# EAGLE design placa_painel (EAGLE 9.5.0)

## Sheet 1 of 2
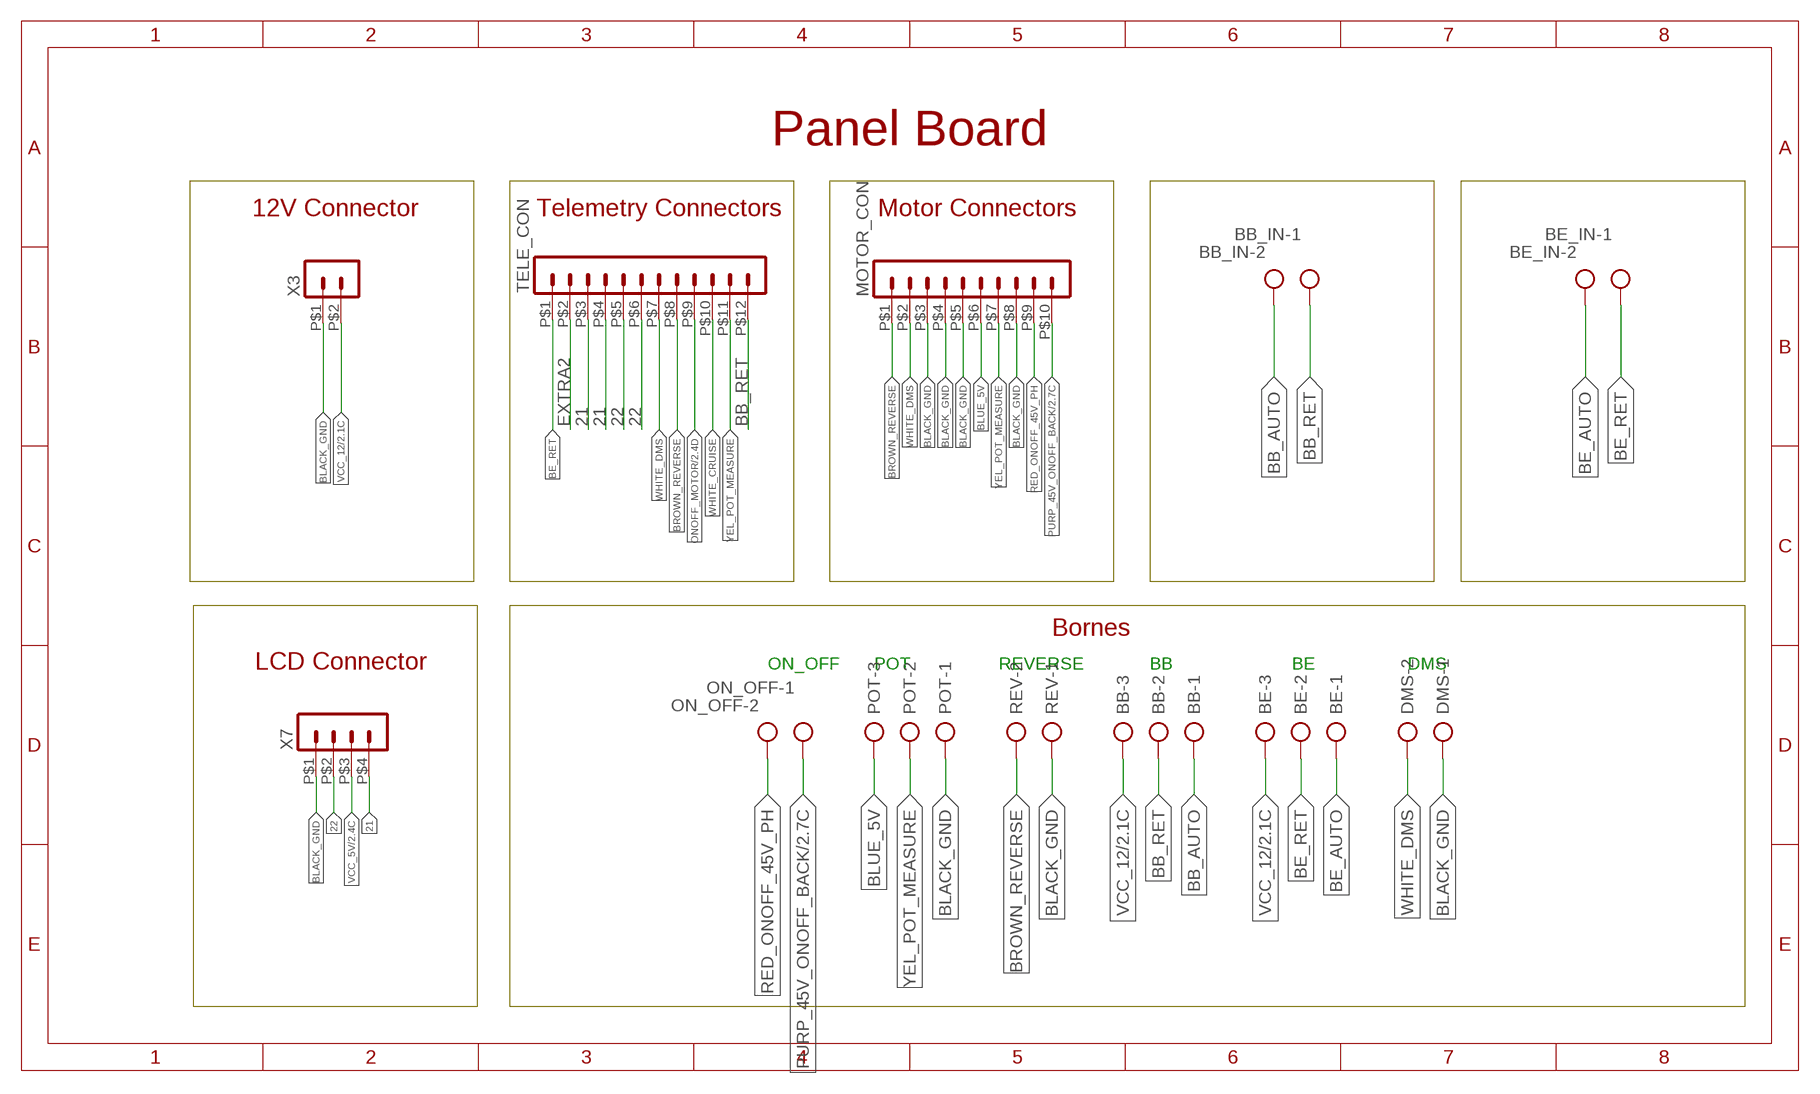
[diagram p0: schematic, sheet 1]

### Parts
BB  AK500/3  [AK500/3]
BB_IN  AK500/2  [AK500/2]
BE  AK500/3  [AK500/3]
BE_IN  AK500/2  [AK500/2]
DMS  AK500/2  [AK500/2]
MOTOR_CON  HEADER_POS10_43045-1012  [43045-1012]
ON_OFF  AK500/2  [AK500/2]
POT  AK500/3  [AK500/3]
REV  AK500/2  [AK500/2]
TELE_CON  HEADER_POS12_43045-1212  [43045-1212]
X3  HEADER_POS2_43045-0212  [43045-0212]
X7  HEADER_POS4_43045-0412  [43045-0412]

### Nets
21: TELE_CON.P$3 TELE_CON.P$4 X7.P$4
22: TELE_CON.P$5 TELE_CON.P$6 X7.P$2
BB_AUTO: BB.1 BB_IN.2
BB_RET: BB.2 BB_IN.1 TELE_CON.P$12
BE_AUTO: BE.1 BE_IN.2
BE_RET: BE.2 BE_IN.1 TELE_CON.P$1
BLACK_GND: DMS.1 MOTOR_CON.P$3 MOTOR_CON.P$4 MOTOR_CON.P$5 MOTOR_CON.P$8 POT.1 REV.1 X3.P$1 X7.P$1 ; also sheet 2
BLUE_5V: MOTOR_CON.P$6 POT.3
BROWN_REVERSE: MOTOR_CON.P$1 REV.2 TELE_CON.P$8
EXTRA2: TELE_CON.P$2
ONOFF_MOTOR: TELE_CON.P$9 ; also sheet 2
PURP_45V_ONOFF_BACK: MOTOR_CON.P$10 ON_OFF.1 ; also sheet 2
RED_ONOFF_45V_PH: MOTOR_CON.P$9 ON_OFF.2
VCC_5V: X7.P$3 ; also sheet 2
VCC_12: BB.3 BE.3 X3.P$2 ; also sheet 2
WHITE_CRUISE: TELE_CON.P$10
WHITE_DMS: DMS.2 MOTOR_CON.P$2 TELE_CON.P$7
YEL_POT_MEASURE: MOTOR_CON.P$7 POT.2 TELE_CON.P$11

### Notes on the sheet
- Panel Board
- 12V Connector | Telemetry Connectors | Motor Connectors
- Bornes
- LCD Connector
- ON_OFF | POT | REVERSE | BB | BE | DMS

## Sheet 2 of 2
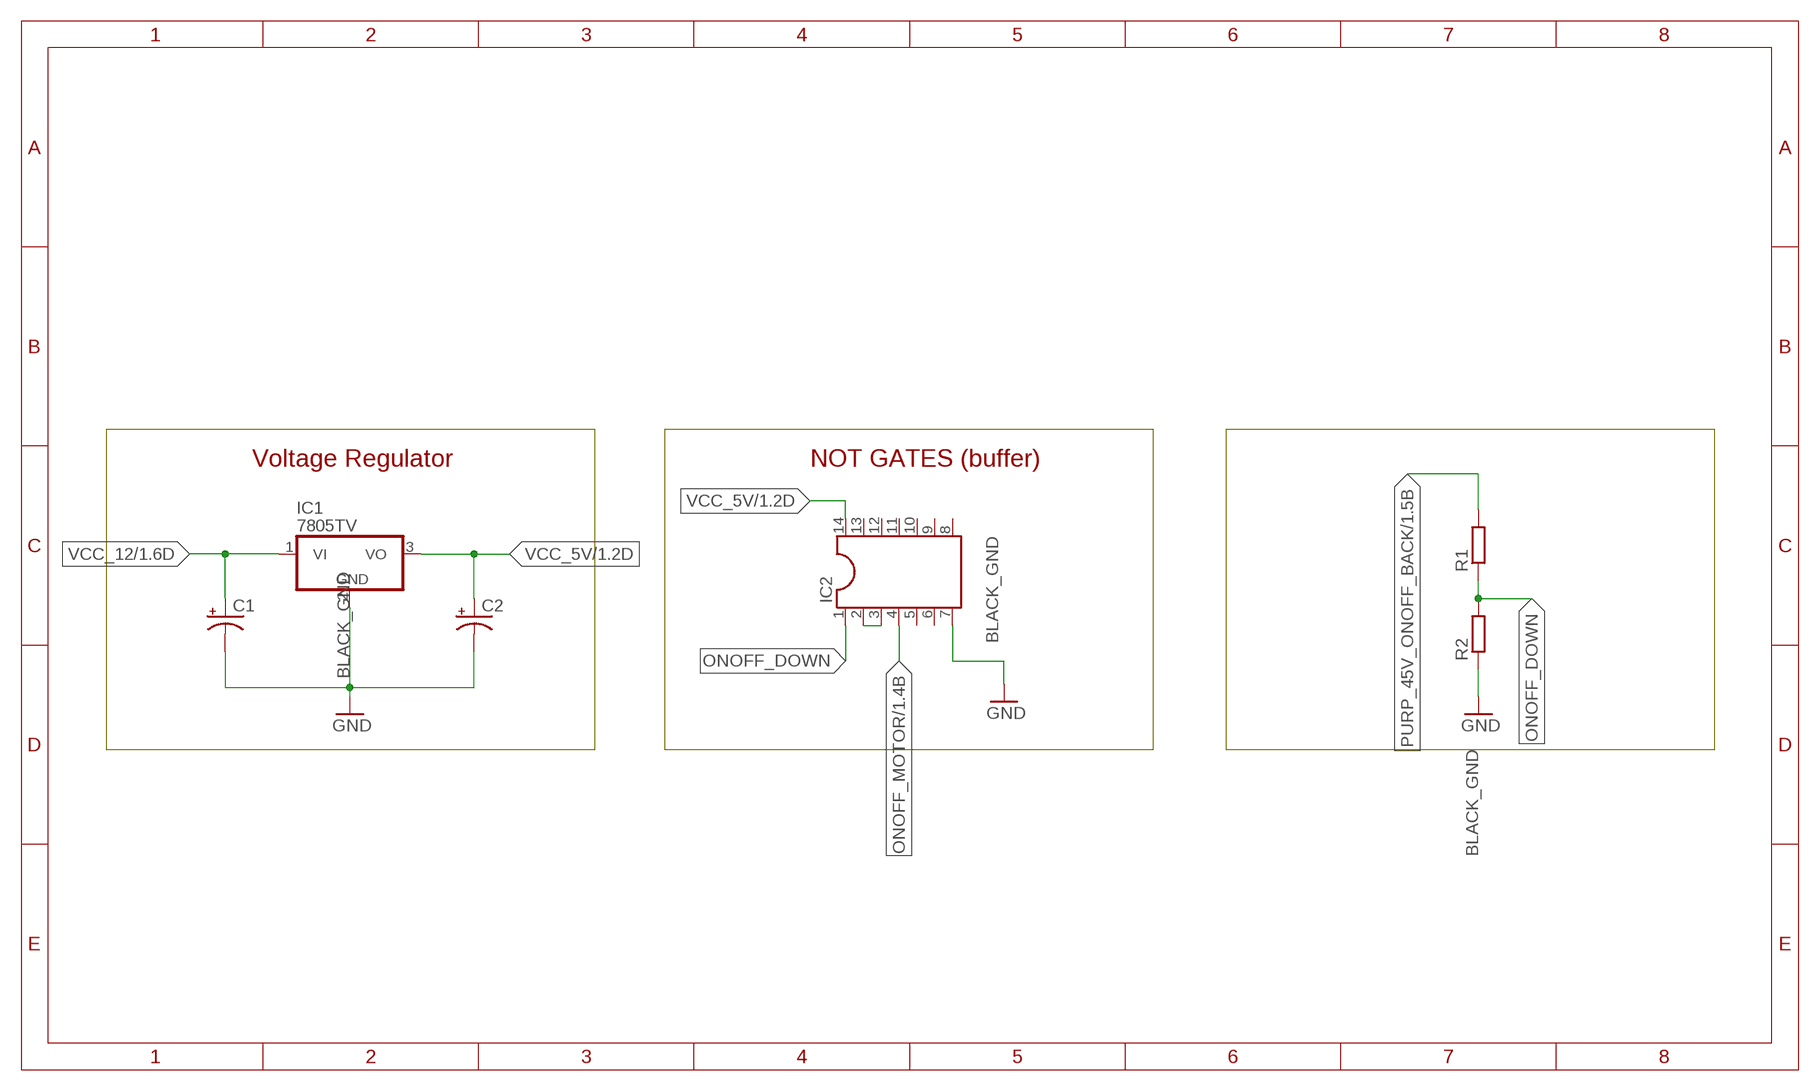
[diagram p1: schematic, sheet 2]

### Parts
C1  CPOL-USE5-5  [E5-5]
C2  CPOL-USE5-5  [E5-5]
IC1  7805TV  [TO220V]
IC2  DIL14  [DIL14]
R1  R-EU_0204/7  [0204/7]
R2  R-EU_0204/7  [0204/7]

### Nets
BLACK_GND: C1.- C2.- IC1.2(GND) IC2.7 R2.1 ; supply symbol labelled GND ; also sheet 1
N$4: IC2.2 IC2.3
ONOFF_DOWN: IC2.1 R1.1 R2.2
ONOFF_MOTOR: IC2.4 ; also sheet 1
PURP_45V_ONOFF_BACK: R1.2 ; also sheet 1
VCC_5V: C2.+ IC1.3(VO) IC2.14 ; also sheet 1
VCC_12: C1.+ IC1.1(VI) ; also sheet 1
Unconnected: IC2.5 IC2.6 IC2.8 IC2.9 IC2.10 IC2.11 IC2.12 IC2.13

### Notes on the sheet
- Voltage Regulator | NOT GATES (buffer)

## Library data of the parts
BB BE POT = con-ptr500:AK500/3: CONNECTOR; OC_FARNELL: unknown; OC_NEWARK: unknown
BB_IN BE_IN DMS ON_OFF REV = con-ptr500:AK500/2: CONNECTOR; OC_FARNELL: unknown; OC_NEWARK: unknown
C1 C2 = rcl:CPOL-US: POLARIZED CAPACITOR, American symbol; SPICEPREFIX: C
IC1 = linear:78*: Positive VOLTAGE REGULATOR Source: http://cache.national.com/ds/LM/LM78L05.pdf http://www.fairchildsemi.com/ds/LM/LM7805.pdf
IC2 = ic-package:DIL14: Dual In Line / Socket
MOTOR_CON = con-molex-micro-fit-3_0:HEADER_POS10_?: Molex - Micro-Fit 3.0 Series connector, 3.00mm (0.118") pitch header, 10 positions.
R1 R2 = rcl:R-EU_: RESISTOR, European symbol; SPICEPREFIX: R
TELE_CON = con-molex-micro-fit-3_0:HEADER_POS12_?: Molex - Micro-Fit 3.0 Series connector, 3.00mm (0.118") pitch header, 12 positions.
X3 = con-molex-micro-fit-3_0:HEADER_POS2_?: Molex - Micro-Fit 3.0 Series connector, 3.00mm (0.118") pitch header, 2 positions.
X7 = con-molex-micro-fit-3_0:HEADER_POS4_?: Molex - Micro-Fit 3.0 Series connector, 3.00mm (0.118") pitch header, 4 positions.

## Board
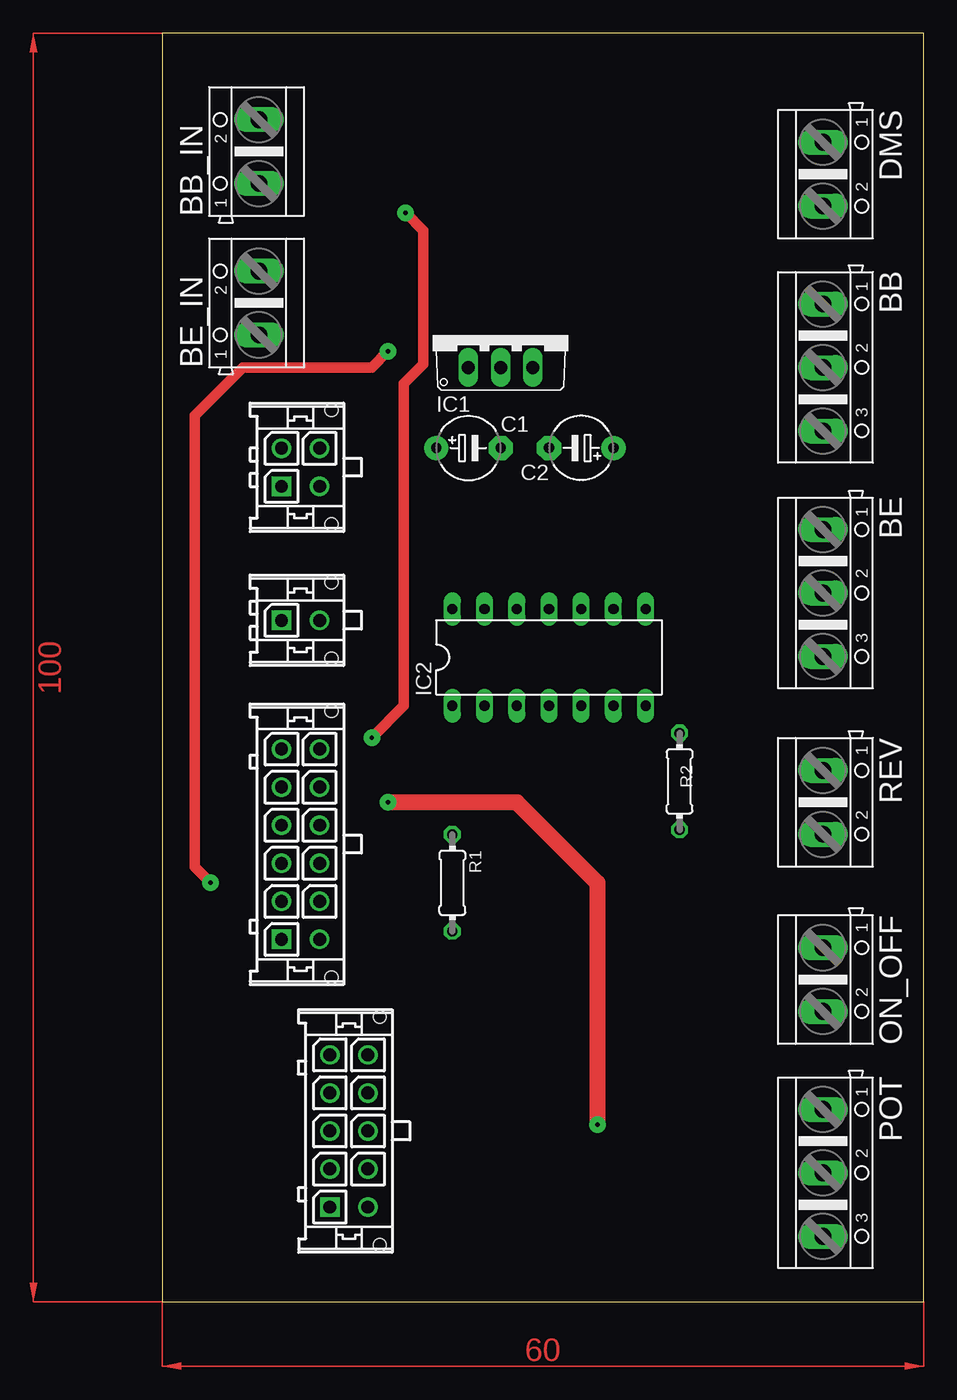
[diagram p2: board, top side]
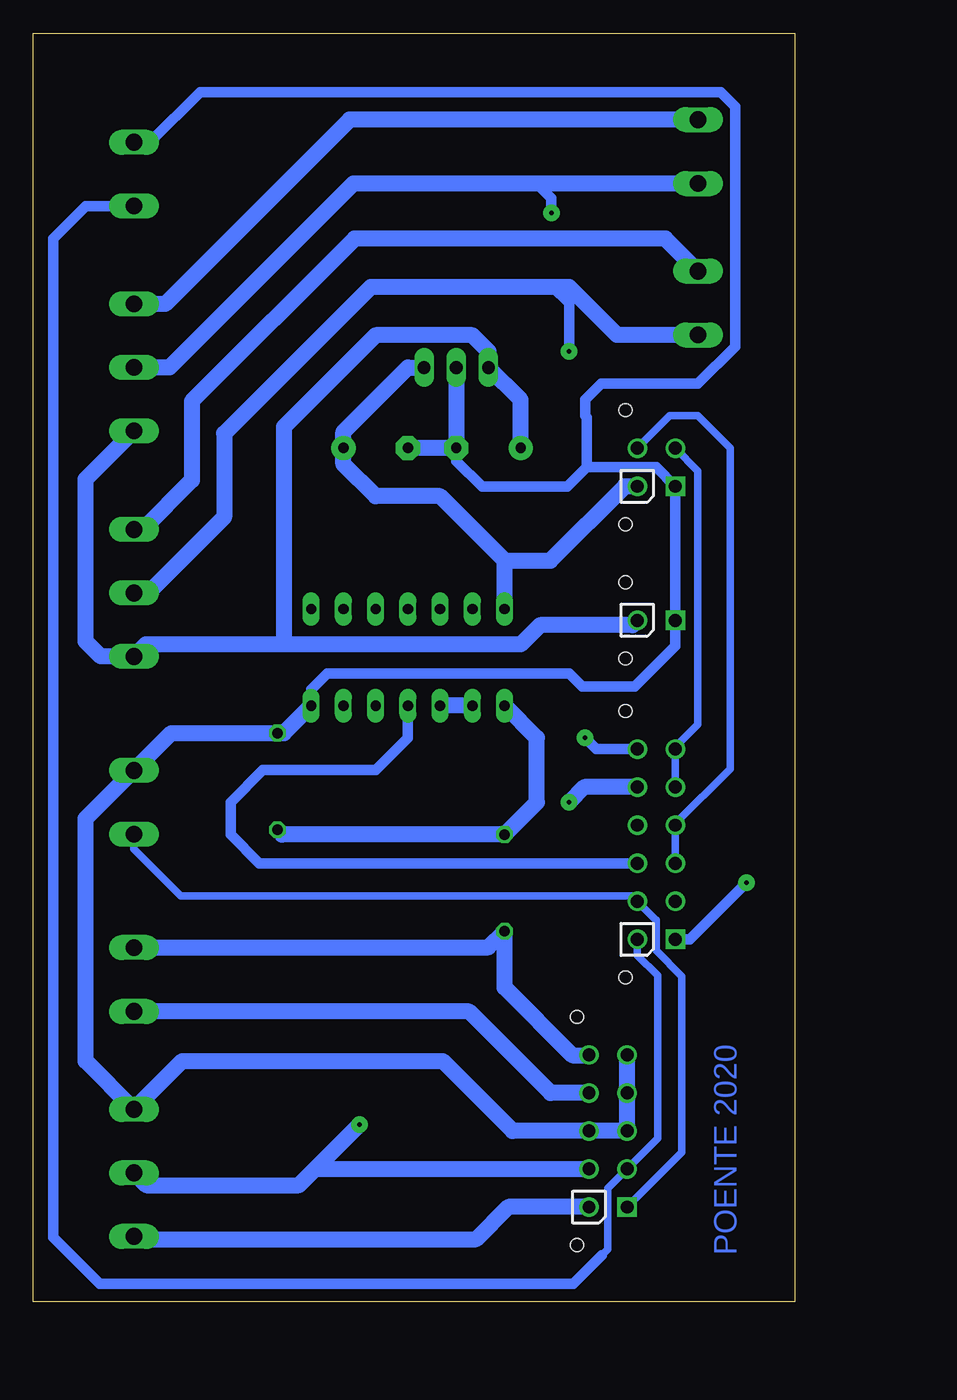
[diagram p3: board, bottom side, seen from below]

Size 60 x 100 mm. Coordinates in mm from the lower left corner, seen from the top.
Outline: 0,0 60,0 60,100 0,100 0,0
Copper layers (1*16): Top 0.035mm / dielectric 1.5mm / Bottom 0.035mm
Design rules "default": minimum track width 6mil, minimum drill 0.35mm, track to track 6mil, track to pad 6mil, pad to pad 6mil, via to via 6mil, smd to smd 6mil, copper to edge 40mil, drill to drill 6mil, minimum pad ring 10mil, minimum via ring 8mil, stop-mask expansion 4mil, vias tented up to drill 0mil, thermal gap 10mil

### Footprints (pad centres in the part's own frame; a part is rotated, then mirrored left to right if it is on the bottom)
AK500/3 = drill 1.321 long: 1 -5.004,0; 2 0,0; 3 5.004,0
AK500/2 = drill 1.321 long: 1 -2.515,0; 2 2.515,0
E5-5 = drill 0.813 pad 1.905: + -2.54,0 | drill 0.813 pad 1.905 octagon: - 2.54,0
TO220V = drill 1.016 long: 1 -2.54,-2.54; 2 0,-2.54; 3 2.54,-2.54
DIL14 = drill 0.813 long: 1 -7.62,-3.81; 2 -5.08,-3.81; 3 -2.54,-3.81; 4 0,-3.81; 5 2.54,-3.81; 6 5.08,-3.81; 7 7.62,-3.81; 8 7.62,3.81; 9 5.08,3.81; 10 2.54,3.81; 11 0,3.81; 12 -2.54,3.81; 13 -5.08,3.81; 14 -7.62,3.81
43045-1012 = drill 1.02 square: P$1 6,0 | drill 1.02: P$2 3,0; P$3 0,0; P$4 -3,0; P$5 -6,0; P$6 6,3; P$7 3,3; P$8 0,3; P$9 -3,3; P$10 -6,3 | hole 1.02: 9,3.94; -9,3.94
0204/7 = drill 0.813 octagon: 1 -3.81,0; 2 3.81,0
43045-1212 = drill 1.02 square: P$1 7.5,0 | drill 1.02: P$2 4.5,0; P$3 1.5,0; P$4 -1.5,0; P$5 -4.5,0; P$6 -7.5,0; P$7 7.5,3; P$8 4.5,3; P$9 1.5,3; P$10 -1.5,3; P$11 -4.5,3; P$12 -7.5,3 | hole 1.02: 10.5,3.94; -10.5,3.94
43045-0212 = drill 1.02 square: P$1 0,0 | drill 1.02: P$2 0,3 | hole 1.02: 3,3.94; -3,3.94
43045-0412 = drill 1.02 square: P$1 1.5,0 | drill 1.02: P$2 -1.5,0; P$3 1.5,3; P$4 -1.5,3 | hole 1.02: 4.5,3.94; -4.5,3.94

### Placement (x,y rotation side)
BB  52.07,73.66 270 top
BB_IN  7.62,90.68 90 top
BE  52.07,55.88 270 top
BE_IN  7.62,78.74 90 top
C1  24.13,67.31 0 top
C2  33.02,67.31 180 top
DMS  52.07,88.9 270 top
IC1  26.67,76.2 0 top
IC2  30.48,50.8 0 top
MOTOR_CON  13.21,13.46 270 top
ON_OFF  52.07,25.4 270 top
POT  52.07,10.16 270 top
R1  22.86,33.02 270 top
R2  40.77,41.02 270 top
REV  52.07,39.37 270 top
TELE_CON  9.4,36.07 270 top
X3  9.4,53.72 270 top
X7  9.4,65.79 270 top

### Tracks (layer width: path | path; a pad name or v marks a point on that pad's centre or on a via)
21
  Bottom 0.61: TELE_CON.P$3 TELE_CON.P$4 9.4,37.7 5.08,42.01 5.08,67.31 7.62,69.85 9.83,69.85 X7.P$4
22
  Bottom 0.61: TELE_CON.P$6 TELE_CON.P$5 9.4,43.74 7.62,45.52 7.62,65.51 X7.P$2
BB_AUTO
  Bottom 1.27: BB_IN.2 35.08,93.19 49.61,78.66 BB.1
BB_RET  (via drill 0.35 pad 1.3)
  Top 0.813: v16.51,44.45 19.05,46.99 19.05,72.39 20.57,73.91 20.57,84.45 v19.18,85.85
  Bottom 0.813: TELE_CON.P$12 15.63,43.57 v16.51,44.45 | v19.18,85.85 19.18,87.02 20.32,88.16
  Bottom 1.27: BB_IN.1 20.32,88.16 34.77,88.16 49.28,73.66 BB.2
BE_AUTO
  Bottom 1.27: BE_IN.2 10.19,83.82 34.67,83.82 47.5,70.99 47.5,64.77 51.38,60.88 BE.1
BE_RET  (via drill 0.35 pad 1.3)
  Top 0.813: v3.81,33.02 2.54,34.29 2.54,69.85 6.35,73.66 16.51,73.66 v17.78,74.93
  Bottom 0.813: TELE_CON.P$1 8.26,28.57 v3.81,33.02 | v17.78,74.93 17.78,78.74 19.05,80.01
  Bottom 1.27: BE_IN.1 13.99,76.22 17.78,80.01 19.05,80.01 33.4,80.01 44.96,68.45 44.96,61.85 50.93,55.88 BE.2
BLACK_GND
  Bottom 0.813: IC2.7 38.1,48.26 36.83,49.53 17.78,49.53 16.75,48.5 12.59,48.5 9.4,51.69 X3.P$1 X7.P$1 10.9,65.79 16.38,65.79 | C1.- 26.67,66.29 24.64,64.26 17.91,64.26 16.38,65.79 | 16.38,65.79 16.38,69.72 16.51,69.85 16.51,71.12 15.24,72.39 7.62,72.39 4.7,75.31 4.7,94.23 5.84,95.38 46.86,95.38 50.83,91.42 DMS.1
  Bottom 1.27: MOTOR_CON.P$5 MOTOR_CON.P$4 MOTOR_CON.P$3 MOTOR_CON.P$8 22.23,13.46 27.74,18.97 48.26,18.97 POT.1 55.88,18.97 55.88,38.1 52.09,41.88 REV.1 49.12,44.83 R2.1 40.26,44.83 IC2.7 | IC1.2 C1.- C2.-
BLUE_5V
  Bottom 1.27: MOTOR_CON.P$6 22.56,7.46 25.1,4.92 51.84,4.92 POT.3
BROWN_REVERSE
  Bottom 0.61: REV.2 52.07,35.69 48.39,32 12.83,32 TELE_CON.P$8 10.93,30.1 10.92,30.1 10.92,27.69 8.89,25.65 8.89,11.78 MOTOR_CON.P$1
N$4
  Bottom 1.27: IC2.2 IC2.3
ONOFF_DOWN
  Bottom 1.27: R2.2 40.39,36.83 R1.1 20.32,39.37 20.32,44.45 IC2.1
ONOFF_MOTOR
  Bottom 0.813: TELE_CON.P$9 42.19,34.57 44.45,36.83 44.45,39.37 41.91,41.91 33.02,41.91 30.48,44.45 IC2.4
PURP_45V_ONOFF_BACK
  Bottom 1.27: ON_OFF.1 52.05,27.94 24.13,27.94 R1.2 22.86,24.77 17.53,19.43 16.24,19.43 MOTOR_CON.P$10
RED_ONOFF_45V_PH
  Bottom 1.27: MOTOR_CON.P$9 19.23,16.46 25.65,22.89 ON_OFF.2
VCC_5V
  Bottom 1.27: X7.P$3 13.39,64.29 19.26,58.42 22.86,58.42 | 22.86,58.42 27.94,63.5 33.02,63.5 35.56,66.04 C2.+ 35.56,68.58 30.48,73.66 IC1.3 | IC2.14 22.86,58.42
VCC_12
  Bottom 1.27: C1.+ 21.59,71.12 IC1.1 24.13,74.93 25.4,76.2 33.02,76.2 40.26,68.96 40.26,51.82 | X3.P$2 12.78,53.34 20.07,53.34 21.59,51.82 40.26,51.82 | 40.26,51.82 51.13,51.82 BE.3 54.69,50.88 55.88,52.07 55.88,64.85 BB.3
WHITE_DMS
  Bottom 0.61: TELE_CON.P$7 12.4,27.32 10.79,25.72 10.79,12.88 MOTOR_CON.P$2 14.73,8.94 14.73,4.14 15.22,3.66
  Bottom 0.813: DMS.2 52.09,86.36 55.88,86.36 58.42,83.82 58.42,5.08 54.76,1.42 17.45,1.42 15.22,3.66
YEL_POT_MEASURE  (via drill 0.35 pad 1.3)
  Top 1.27: v34.29,13.97 34.29,33.02 27.94,39.37 v17.78,39.37
  Bottom 1.016: MOTOR_CON.P$7 16.51,10.46
  Bottom 1.27: POT.2 51.1,9.19 39.07,9.19 37.8,10.46 | 37.8,10.46 16.51,10.46 | TELE_CON.P$11 16.58,40.57 v17.78,39.37 | v34.29,13.97 37.8,10.46
(copper drawn outside any net)
  shapes: Top area x2

### Text on the board
Bottom: POENTE 2020